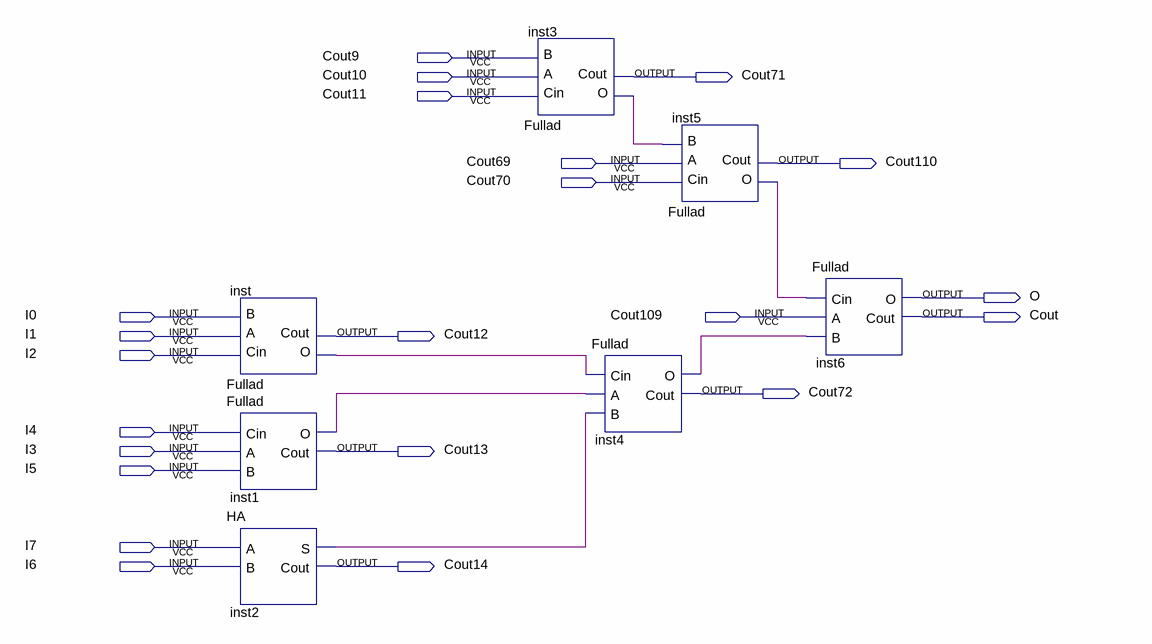
[diagram p0: schematic sheet]
// Quartus schematic B16.bdf as structural Verilog: 7 symbols, 22 pins
module B16 (
  input  Cout9,
  input  Cout10,
  input  Cout11,
  input  Cout69,
  input  Cout70,
  input  I0,
  input  Cout109,
  input  I1,
  input  I2,
  input  I4,
  input  I3,
  input  I5,
  input  I7,
  input  I6,
  output Cout71,
  output Cout110,
  output O,
  output Cout,
  output Cout12,
  output Cout72,
  output Cout13,
  output Cout14
);

  wire inst1_o, inst2_s, inst3_o, inst4_o, inst5_o, inst_o;

  Fullad inst (.Cin(I2), .A(I1), .B(I0), .O(inst_o), .Cout(Cout12));
  Fullad inst1 (.Cin(I4), .A(I3), .B(I5), .O(inst1_o), .Cout(Cout13));
  HA inst2 (.A(I7), .B(I6), .S(inst2_s), .Cout(Cout14));
  Fullad inst3 (.Cin(Cout11), .A(Cout10), .B(Cout9), .O(inst3_o), .Cout(Cout71));
  Fullad inst4 (.Cin(inst_o), .A(inst1_o), .B(inst2_s), .O(inst4_o), .Cout(Cout72));
  Fullad inst5 (.Cin(Cout70), .A(Cout69), .B(inst3_o), .O(inst5_o), .Cout(Cout110));
  Fullad inst6 (.Cin(inst5_o), .A(Cout109), .B(inst4_o), .O(O), .Cout(Cout));
endmodule
